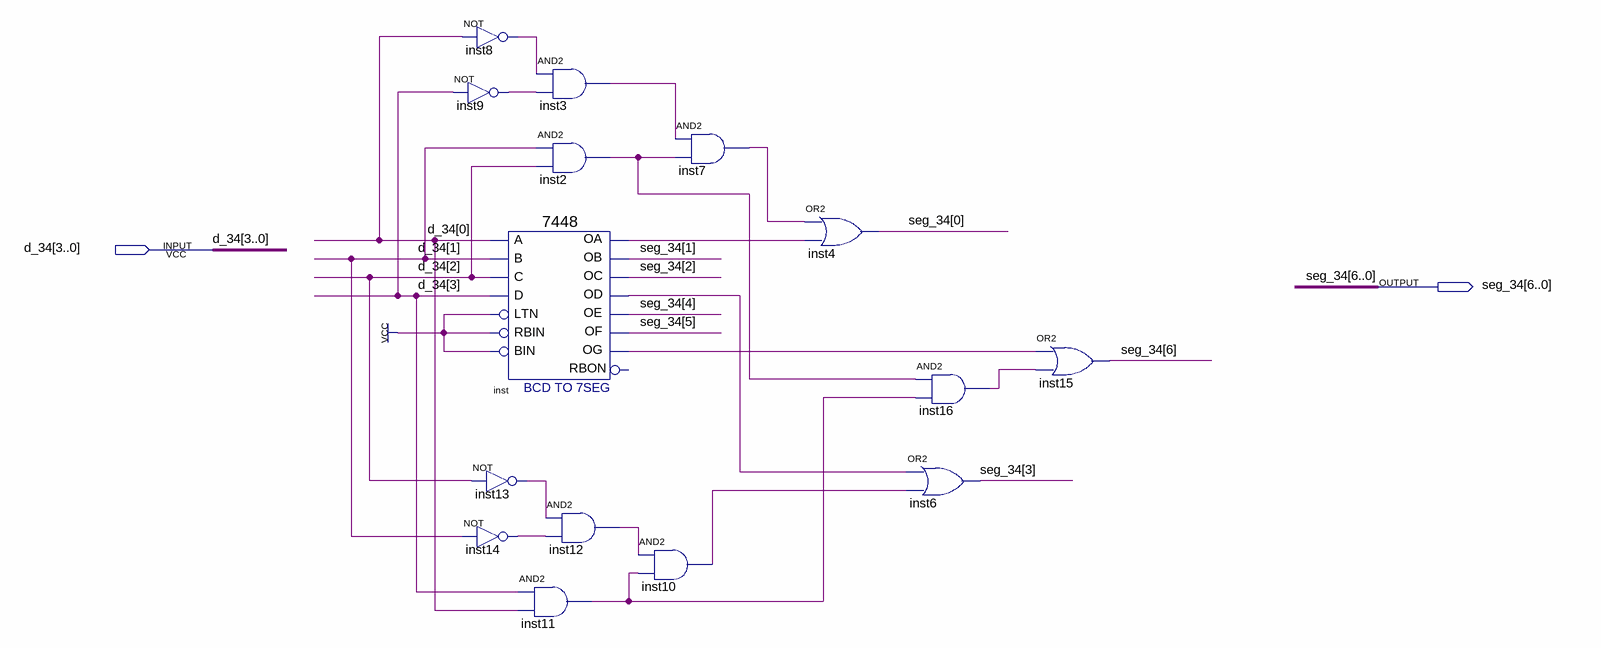
[diagram p0: schematic sheet]
// Quartus schematic docker_34.bdf as structural Verilog: 15 symbols, 2 pins
module docker_34 (
  input  [3:0] d_34,
  output [6:0] seg_34
);

  wire inst2_out, inst3_out, inst7_out, inst8_out, inst9_out, inst10_out, inst11_out, inst12_out, inst13_out,
       inst14_out, inst16_out, inst_oa, inst_od, inst_og;

  not inst8 (inst8_out, d_34[0]);
  not inst9 (inst9_out, d_34[3]);
  \7448  inst (
    .A(d_34[0]), .C(d_34[2]), .D(d_34[3]), .B(d_34[1]), .RBIN(1'b1), .BIN(1'b1), .LTN(1'b1), .OC(seg_34[2]),
    .OE(seg_34[4]), .OD(inst_od), .OF(seg_34[5]), .OG(inst_og), .OB(seg_34[1]), .OA(inst_oa));  // open: RBON
  not inst13 (inst13_out, d_34[2]);
  not inst14 (inst14_out, d_34[1]);
  and inst11 (inst11_out, d_34[3], d_34[0]);
  and inst3 (inst3_out, inst8_out, inst9_out);
  and inst2 (inst2_out, d_34[1], d_34[2]);
  and inst12 (inst12_out, inst13_out, inst14_out);
  and inst10 (inst10_out, inst12_out, inst11_out);
  and inst7 (inst7_out, inst3_out, inst2_out);
  or inst4 (seg_34[0], inst7_out, inst_oa);
  and inst16 (inst16_out, inst2_out, inst11_out);
  or inst6 (seg_34[3], inst_od, inst10_out);
  or inst15 (seg_34[6], inst_og, inst16_out);
endmodule
